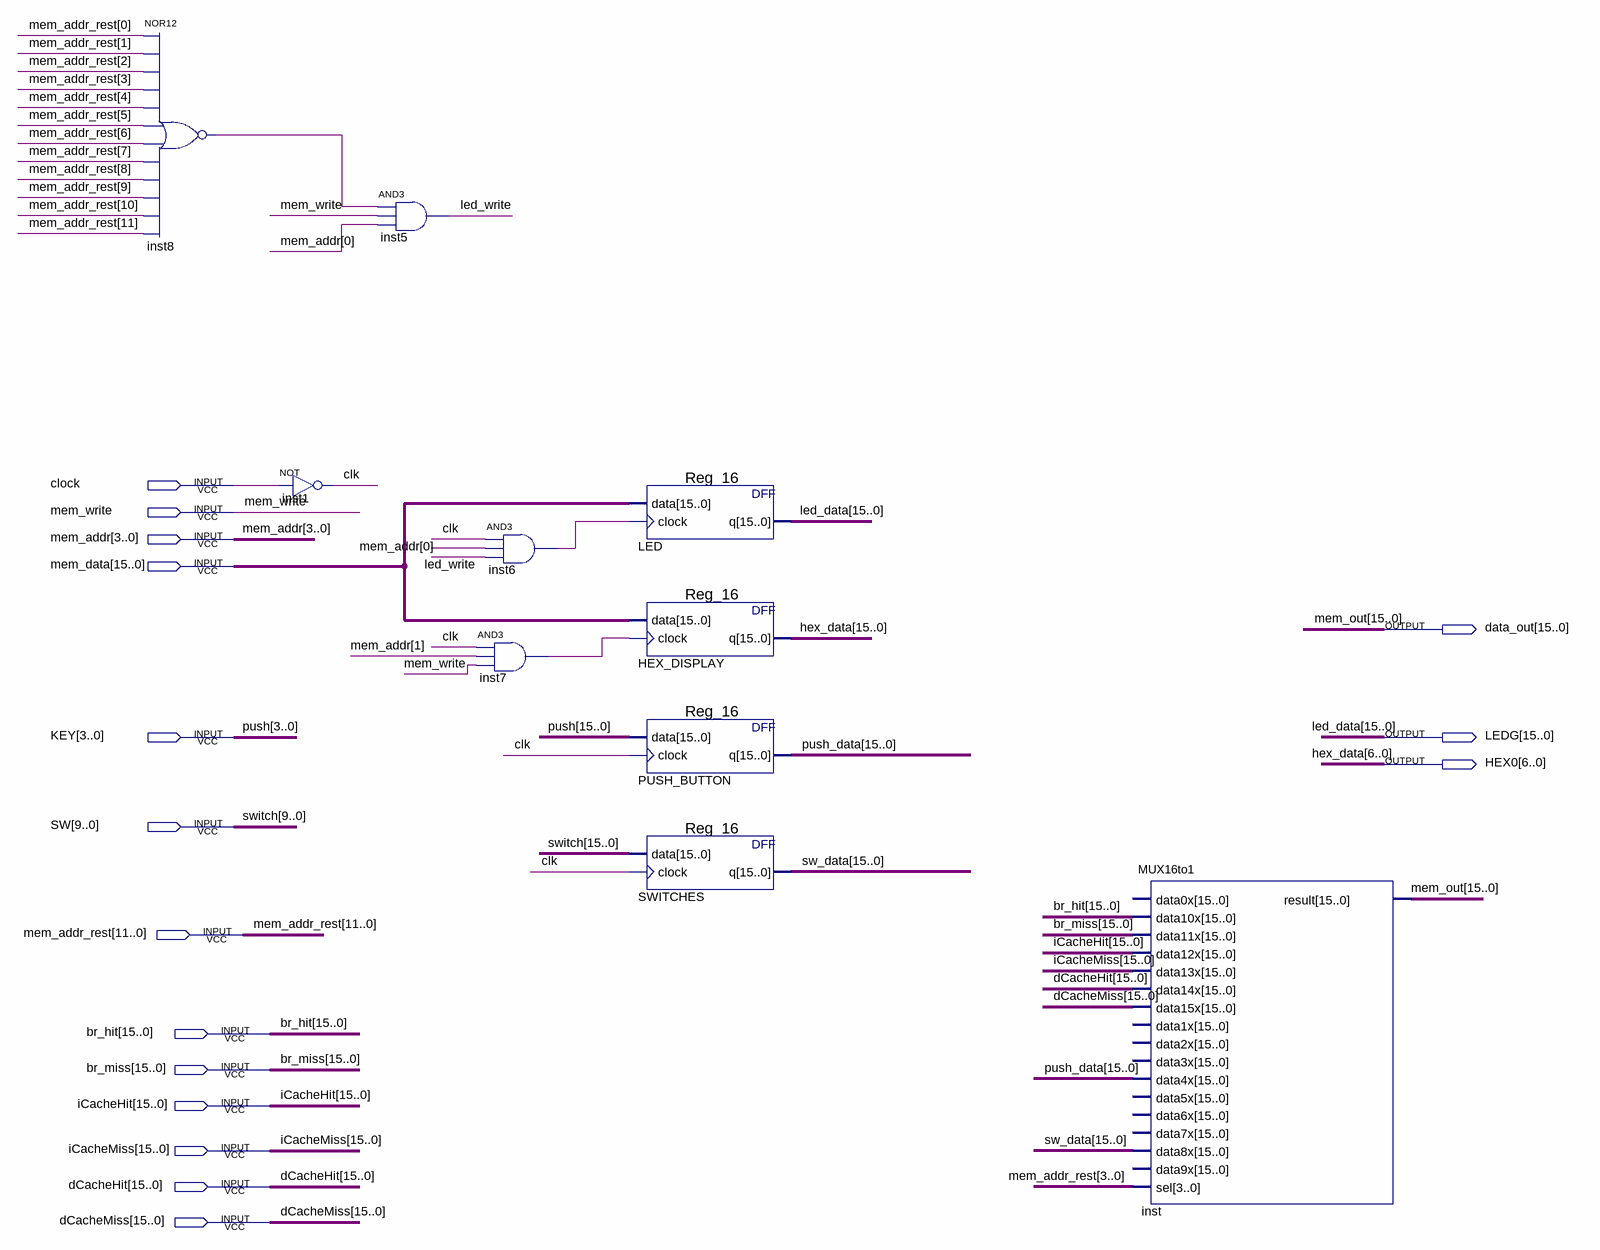
[diagram p0: schematic sheet]
// Quartus schematic IO_MemoryInterface.bdf as structural Verilog: 10 symbols, 16 pins
module IO_MemoryInterface (
  input  clock,
  input  mem_write,
  input  [3:0] mem_addr,
  input  [15:0] mem_data,
  input  [3:0] KEY,
  input  [9:0] SW,
  input  [11:0] mem_addr_rest,
  input  [15:0] br_hit,
  input  [15:0] br_miss,
  input  [15:0] iCacheHit,
  input  [15:0] iCacheMiss,
  input  [15:0] dCacheHit,
  input  [15:0] dCacheMiss,
  output [15:0] data_out,
  output [15:0] LEDG,
  output [6:0] HEX0
);

  wire clk, inst6_out, inst7_out, inst8_out, led_write;
  wire [15:0] push_data, sw_data;
  wire [15:4] push;
  wire [15:7] hex_data;
  wire [15:10] switch;

  nor inst8 (inst8_out, mem_addr_rest[0], mem_addr_rest[1], mem_addr_rest[2], mem_addr_rest[3], mem_addr_rest[4], mem_addr_rest[5], mem_addr_rest[6], mem_addr_rest[7], mem_addr_rest[8], mem_addr_rest[9], mem_addr_rest[10], mem_addr_rest[11]);
  not inst1 (clk, clock);
  and inst5 (led_write, inst8_out, mem_write, mem_addr[0]);
  and inst6 (inst6_out, clk, mem_addr[0], led_write);
  and inst7 (inst7_out, clk, mem_addr[1], mem_write);
  Reg_16 LED (.data(mem_data), .clock(inst6_out), .q(LEDG));
  Reg_16 HEX_DISPLAY (.data(mem_data), .clock(inst7_out), .q({hex_data, HEX0}));
  Reg_16 PUSH_BUTTON (.data({push, KEY}), .clock(clk), .q(push_data));
  Reg_16 SWITCHES (.data({switch, SW}), .clock(clk), .q(sw_data));
  MUX16to1 inst (
    .data10x(br_hit), .data11x(br_miss), .data12x(iCacheHit), .data13x(iCacheMiss), .data14x(dCacheHit),
    .data15x(dCacheMiss), .data4x(push_data), .data8x(sw_data), .sel(mem_addr_rest[3:0]), .result(data_out));  // open: data0x, data1x, data2x, data3x, data5x, data6x, data7x, data9x

  // Other names for the same wires on the sheet: hex_data[6:0] = HEX0; led_data[15:0] = LEDG;
  //   mem_out[15:0] = data_out; push[3:0] = KEY; switch[9:0] = SW
endmodule
